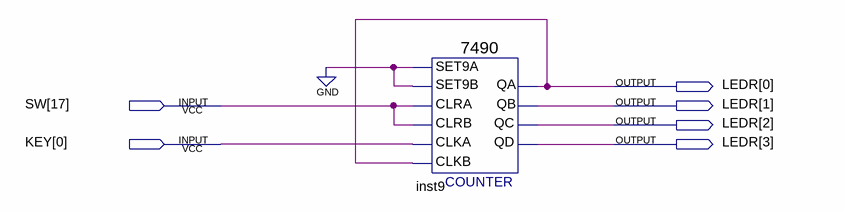
[diagram p0: schematic sheet]
// Quartus schematic dm7490.bdf as structural Verilog: 1 symbols, 6 pins
module dm7490 (
  input  [17:17] SW,
  input  [0:0] KEY,
  output [3:0] LEDR
);

  \7490  inst9 (
    .SET9A(1'b0), .CLRA(SW[17]), .SET9B(1'b0), .CLKB(LEDR[0]), .CLKA(KEY[0]), .CLRB(SW[17]), .QD(LEDR[3]),
    .QA(LEDR[0]), .QB(LEDR[1]), .QC(LEDR[2]));
endmodule
